# EAGLE schematic output_cpld (EAGLE 8.7.0)
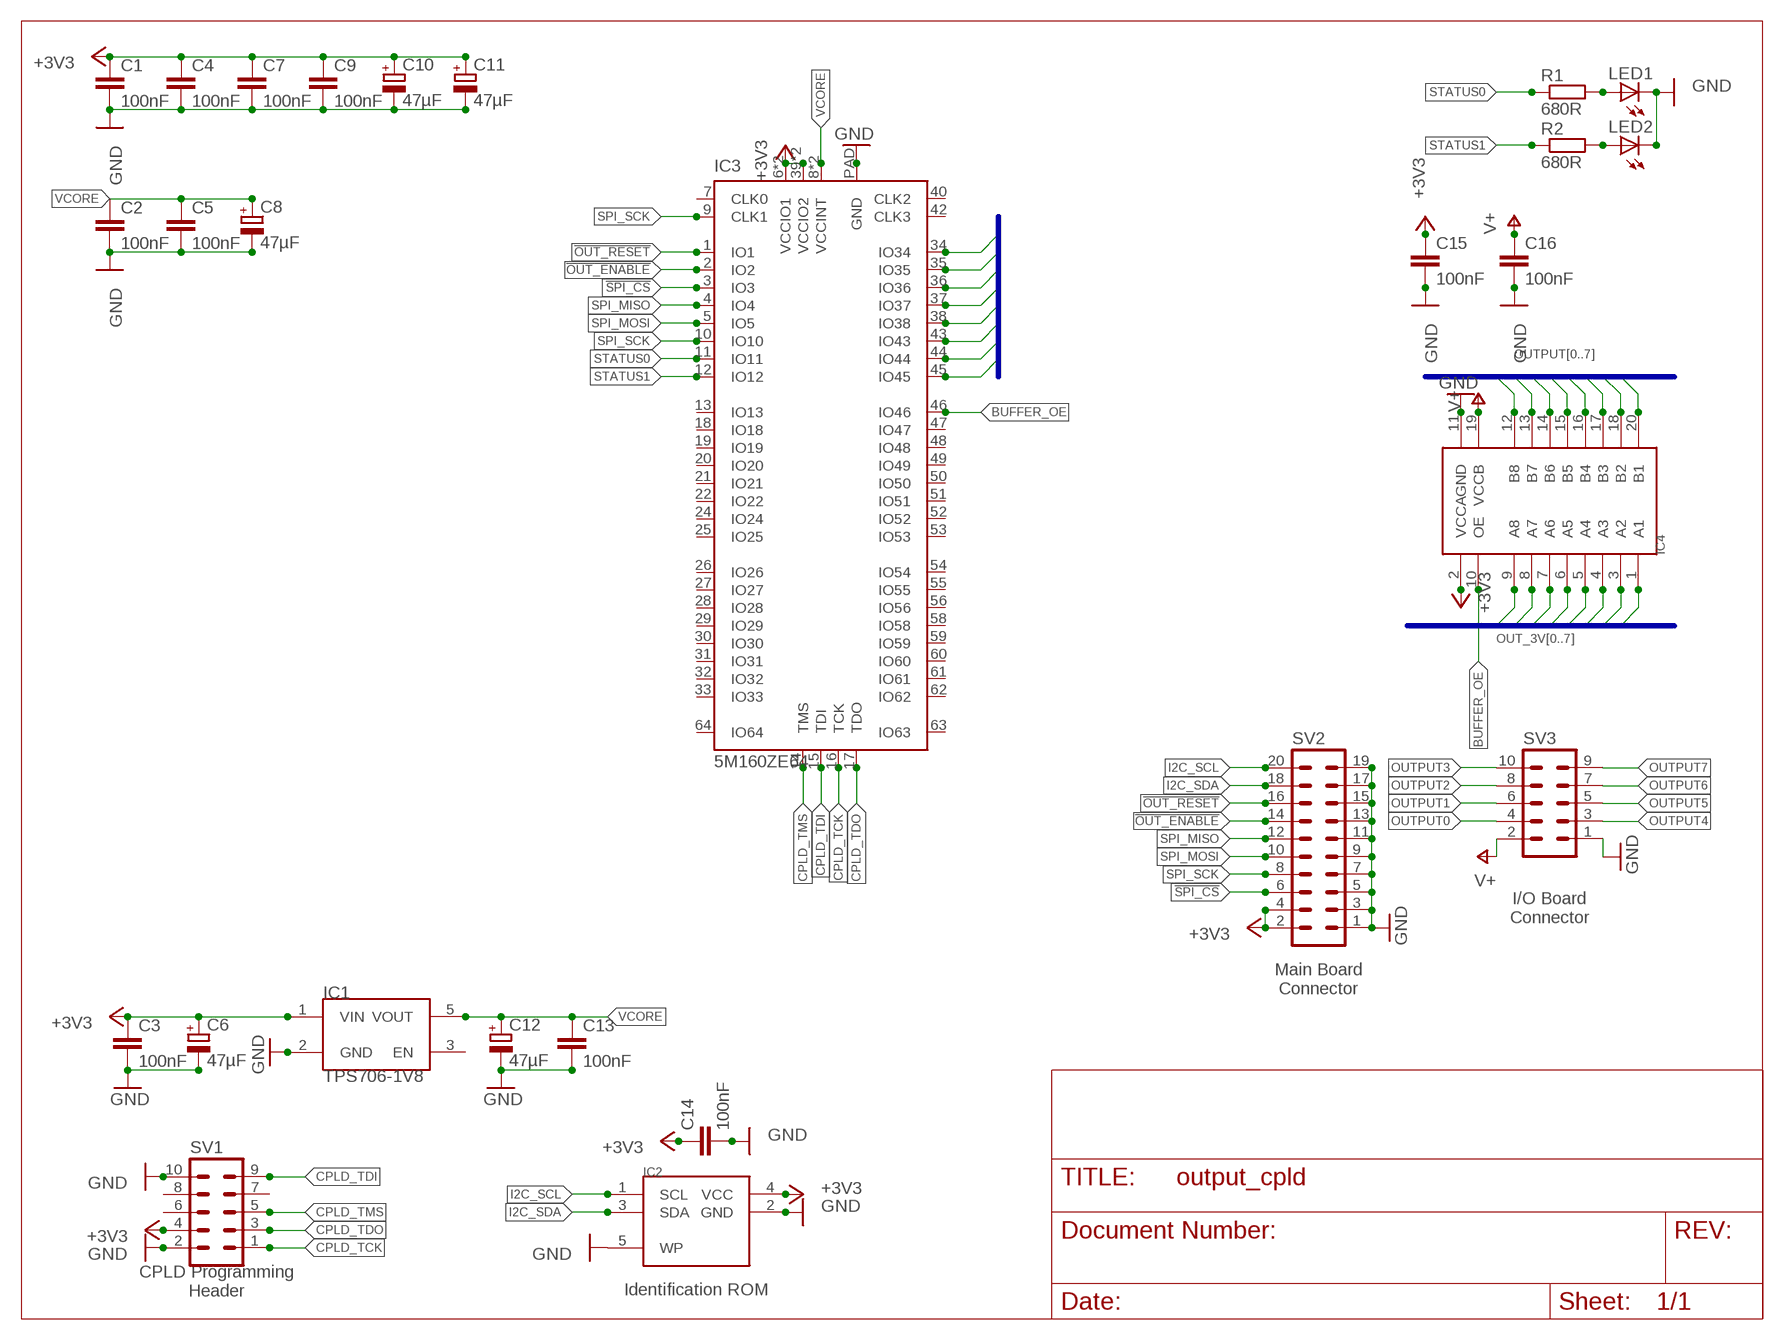
[diagram p0: schematic, sheet 1]

## Parts
C1  100nF  C-EUC0805  [C0805]
C2  100nF  C-EUC0805  [C0805]
C3  100nF  C-EUC0805  [C0805]
C4  100nF  C-EUC0805  [C0805]
C5  100nF  C-EUC0805  [C0805]
C6  47µF  CPOL-EUCT6032  [CT6032]
C7  100nF  C-EUC0805  [C0805]
C8  47µF  CPOL-EUCT6032  [CT6032]
C9  100nF  C-EUC0805  [C0805]
C10  47µF  CPOL-EUCT6032  [CT6032]
C11  47µF  CPOL-EUCT6032  [CT6032]
C12  47µF  CPOL-EUCT6032  [CT6032]
C13  100nF  C-EUC0805  [C0805]
C14  100nF  C-EUC0805  [C0805]
C15  100nF  C-EUC0805  [C0805]
C16  100nF  C-EUC0805  [C0805]
IC1  TPS706-1V8  TPS706SOT23-5  [SOT23-5]
IC2  AT24C02D  [SOT23-5]
IC3  5M160ZE64  [EQFP64]
IC4  TXB0108TSSOP20  [TSSOP20]
LED1  LEDCHIPLED_1206  [CHIPLED_1206]
LED2  LEDCHIPLED_1206  [CHIPLED_1206]
R1  680R  R-EU_M0805  [M0805]
R2  680R  R-EU_M0805  [M0805]
SV1  MA05-2  [MA05-2]
SV2  MA10-2  [MA10-2]
SV3  MA05-2  [MA05-2]

## Nets
!OUT_ENABLE: IC3.2(IO2) SV2.14
!OUT_RESET: IC3.1(IO1) SV2.16
!SPI_CS: IC3.3(IO3) SV2.6
+3V3: C1.1 C3.1 C4.1 C6.+ C7.1 C9.1 C10.+ C11.+ C14.1 C15.1 IC1.1(VIN) IC2.4(VCC) IC3.6(VCCIO1) IC3.23(VCCIO1) IC3.39(VCCIO2) IC3.57(VCCIO2) IC4.2(VCCA) SV1.4 SV2.2 SV2.4
BUFFER_OE: IC3.46(IO46) IC4.10(OE)
CPLD_TCK: IC3.16(TCK) SV1.1
CPLD_TDI: IC3.15(TDI) SV1.9
CPLD_TDO: IC3.17(TDO) SV1.3
CPLD_TMS: IC3.14(TMS) SV1.5
GND: C1.2 C2.2 C3.2 C4.2 C5.2 C6.- C7.2 C8.- C9.2 C10.- C11.- C12.- C13.2 C14.2 C15.2 C16.2 IC1.2(GND) IC2.2(GND) IC2.5(WP) IC3.PAD(GND) IC4.11(GND) LED1.C LED2.C SV1.2 SV1.10 SV2.1 SV2.3 SV2.5 SV2.7 SV2.9 SV2.11 SV2.13 SV2.15 SV2.17 SV2.19 SV3.1
I2C_SCL: IC2.1(SCL) SV2.20
I2C_SDA: IC2.3(SDA) SV2.18
N$13: LED1.A R1.2
N$14: LED2.A R2.2
OUT_3V0: IC3.34(IO34) IC4.1(A1)
OUT_3V1: IC3.35(IO35) IC4.3(A2)
OUT_3V2: IC3.36(IO36) IC4.4(A3)
OUT_3V3: IC3.37(IO37) IC4.5(A4)
OUT_3V4: IC3.38(IO38) IC4.6(A5)
OUT_3V5: IC3.43(IO43) IC4.7(A6)
OUT_3V6: IC3.44(IO44) IC4.8(A7)
OUT_3V7: IC3.45(IO45) IC4.9(A8)
OUTPUT0: IC4.20(B1) SV3.4
OUTPUT1: IC4.18(B2) SV3.6
OUTPUT2: IC4.17(B3) SV3.8
OUTPUT3: IC4.16(B4) SV3.10
OUTPUT4: IC4.15(B5) SV3.3
OUTPUT5: IC4.14(B6) SV3.5
OUTPUT6: IC4.13(B7) SV3.7
OUTPUT7: IC4.12(B8) SV3.9
SPI_MISO: IC3.4(IO4) SV2.12
SPI_MOSI: IC3.5(IO5) SV2.10
SPI_SCK: IC3.9(CLK1) IC3.10(IO10) SV2.8
STATUS0: IC3.11(IO11) R1.1
STATUS1: IC3.12(IO12) R2.1
V+: C16.1 IC4.19(VCCB) SV3.2
VCORE: C2.1 C5.1 C8.+ C12.+ C13.1 IC1.5(VOUT) IC3.8(VCCINT) IC3.41(VCCINT)
Unconnected: IC1.3(EN) IC3.7(CLK0) IC3.13(IO13) IC3.18(IO18) IC3.19(IO19) IC3.20(IO20) IC3.21(IO21) IC3.22(IO22) IC3.24(IO24) IC3.25(IO25) IC3.26(IO26) IC3.27(IO27) IC3.28(IO28) IC3.29(IO29) IC3.30(IO30) IC3.31(IO31) IC3.32(IO32) IC3.33(IO33) IC3.40(CLK2) IC3.42(CLK3) IC3.47(IO47) IC3.48(IO48) IC3.49(IO49) IC3.50(IO50) IC3.51(IO51) IC3.52(IO52) IC3.53(IO53) IC3.54(IO54) IC3.55(IO55) IC3.56(IO56) IC3.58(IO58) IC3.59(IO59) IC3.60(IO60) IC3.61(IO61) IC3.62(IO62) IC3.63(IO63) IC3.64(IO64) SV1.6 SV1.7 SV1.8

## Buses
OUT_3V[0..7]
OUTPUT[0..7]

## Notes on the sheet
- I/O Board
  Connector
- Main Board
  Connector
- CPLD Programming
  Header
- Identification ROM

## Library data of the parts
C1-C5 C7 C9 C13-C16 = rcl:C-EU: CAPACITOR, European symbol; MOUSER: 710-885012207072; SPICEPREFIX: C
C6 C8 C10-C12 = rcl:CPOL-EU: POLARIZED CAPACITOR, European symbol; MOUSER: 581-NOSD107M006; SPICEPREFIX: C
IC1 = lichtenstein_onion:TPS706: 1.8V Out, 150-mA, 1-μA IQ Voltage Regulators with Enable Information <http://www.ti.com/product/tps706>; MOUSER: 595-TPS70618DBVT
IC2 = lichtenstein_onion:AT24C02D; MOUSER: 556-AT24C01D-STUM-T
IC3 = lichtenstein_onion:5M160ZE64: 5M160ZE64 edit this description Auto generated by make-symbol-device-package-bsdl.ulp Rev. 44 Source: 5M160ZE64.bsd; MOUSER: 989-5M160ZE64C5N
IC4 = lichtenstein_onion:TXB0108: 8-Bit Bidirectional Voltage-Level Translator with Auto-Direction Sensing and ±15-kV ESD Protection Datasheet <http://www.ti.com/lit/ds/symlink/txb0108.pdf>; MOUSER: 595-TXB0108PWR
LED1 LED2 = led:LED: LED OSRAM: - CHIPLED LG R971, LG N971, LY N971, LG Q971, LY Q971, LO R971, LY R971 LH N974, LH R974 LS Q976, LO Q976, LY Q976 LO Q996 - Hyper CHIPLED LW Q18S LB Q993, LB Q99A, LB R99A - SideLED LS A670, LO A670, LY A670, LG A670, LP A670 LB A673, LV A673, LT A673, LW A673 LH A674 LY A675 LS A676, LA A676, LO A676, LY A676, LW A676 LS A679, LY A679, LG A679 - Hyper Micro SIDELED® LS Y876, LA Y876, LO Y876, LY Y876 LT Y87S - SmartLED LW L88C, LW L88S LB L89C, LB L89S, LG L890 LS L89K, LO L89K, LY L89K LS L896, LA L896, LO L896, LY L896 - TOPLED LS T670, LO T670, LY T670, LG T670, LP T670 LSG T670, LSP T670, LSY T670, LOP T670, LYG T670 LG T671, LOG T671, LSG T671 LB T673, LV T673, LT T673, LW T673 LH T674 LS T676, LA T676, LO T676, LY T676, LB T676, LH T676, LSB T676, LW T676 LB T67C, LV T67C, LT T67C, LS T67K, LO T67K, LY T67K, LW E67C LS E67B, LA E67B, LO E67B, LY E67B, LB E67C, LV E67C, LT E67C LW T67C LS T679, LY T679, LG T679 LS T770, LO T770, LY T770, LG T770, LP T770 LB T773, LV T773, LT T773, LW T773 LH T774 LS E675, LA E675, LY E675, LS T675 LS T776, LA T776, LO T776, LY T776, LB T776 LHGB T686 LT T68C, LB T68C - Hyper Mini TOPLED® LB M676 - Mini TOPLED Santana® LG M470 LS M47K, LO M47K, LY M47K Source: http://www.osram.convergy.de LUXEON: - LUMILED® LXK2-PW12-R00, LXK2-PW12-S00, LXK2-PW14-U00, LXK2-PW14-V00 LXK2-PM12-R00, LXK2-PM12-S00, LXK2-PM14-U00 LXK2-PE12-Q00, LXK2-PE12-R00, LXK2-PE12-S00, LXK2-PE14-T00, LXK2-PE14-U00 LXK2-PB12-K00, LXK2-PB12-L00, LXK2-PB12-M00, LXK2-PB14-N00, LXK2-PB14-P00, LXK2-PB14-Q00 LXK2-PR12-L00, LXK2-PR12-M00, LXK2-PR14-Q00, LXK2-PR14-R00 LXK2-PD12-Q00, LXK2-PD12-R00, LXK2-PD12-S00 LXK2-PH12-R00, LXK2-PH12-S00 LXK2-PL12-P00, LXK2-PL12-Q00, LXK2-PL12-R00 Source: www.luxeon.com KINGBRIGHT: KA-3528ASYC Source: www.kingbright.com; MOUSER: 604-APTR3216SGC
R1 R2 = rcl:R-EU_: RESISTOR, European symbol; MOUSER: 652-CR0805-FX6800GLF; SPICEPREFIX: R
SV1 SV3 = con-lstb:MA05-2: PIN HEADER; MOUSER: 517-30310-6002; OC_FARNELL: unknown; OC_NEWARK: unknown
SV2 = con-lstb:MA10-2: PIN HEADER; MOUSER: 517-30320-6002; OC_FARNELL: unknown; OC_NEWARK: unknown